# EAGLE design Famicom Controller (EAGLE 9.0.1)
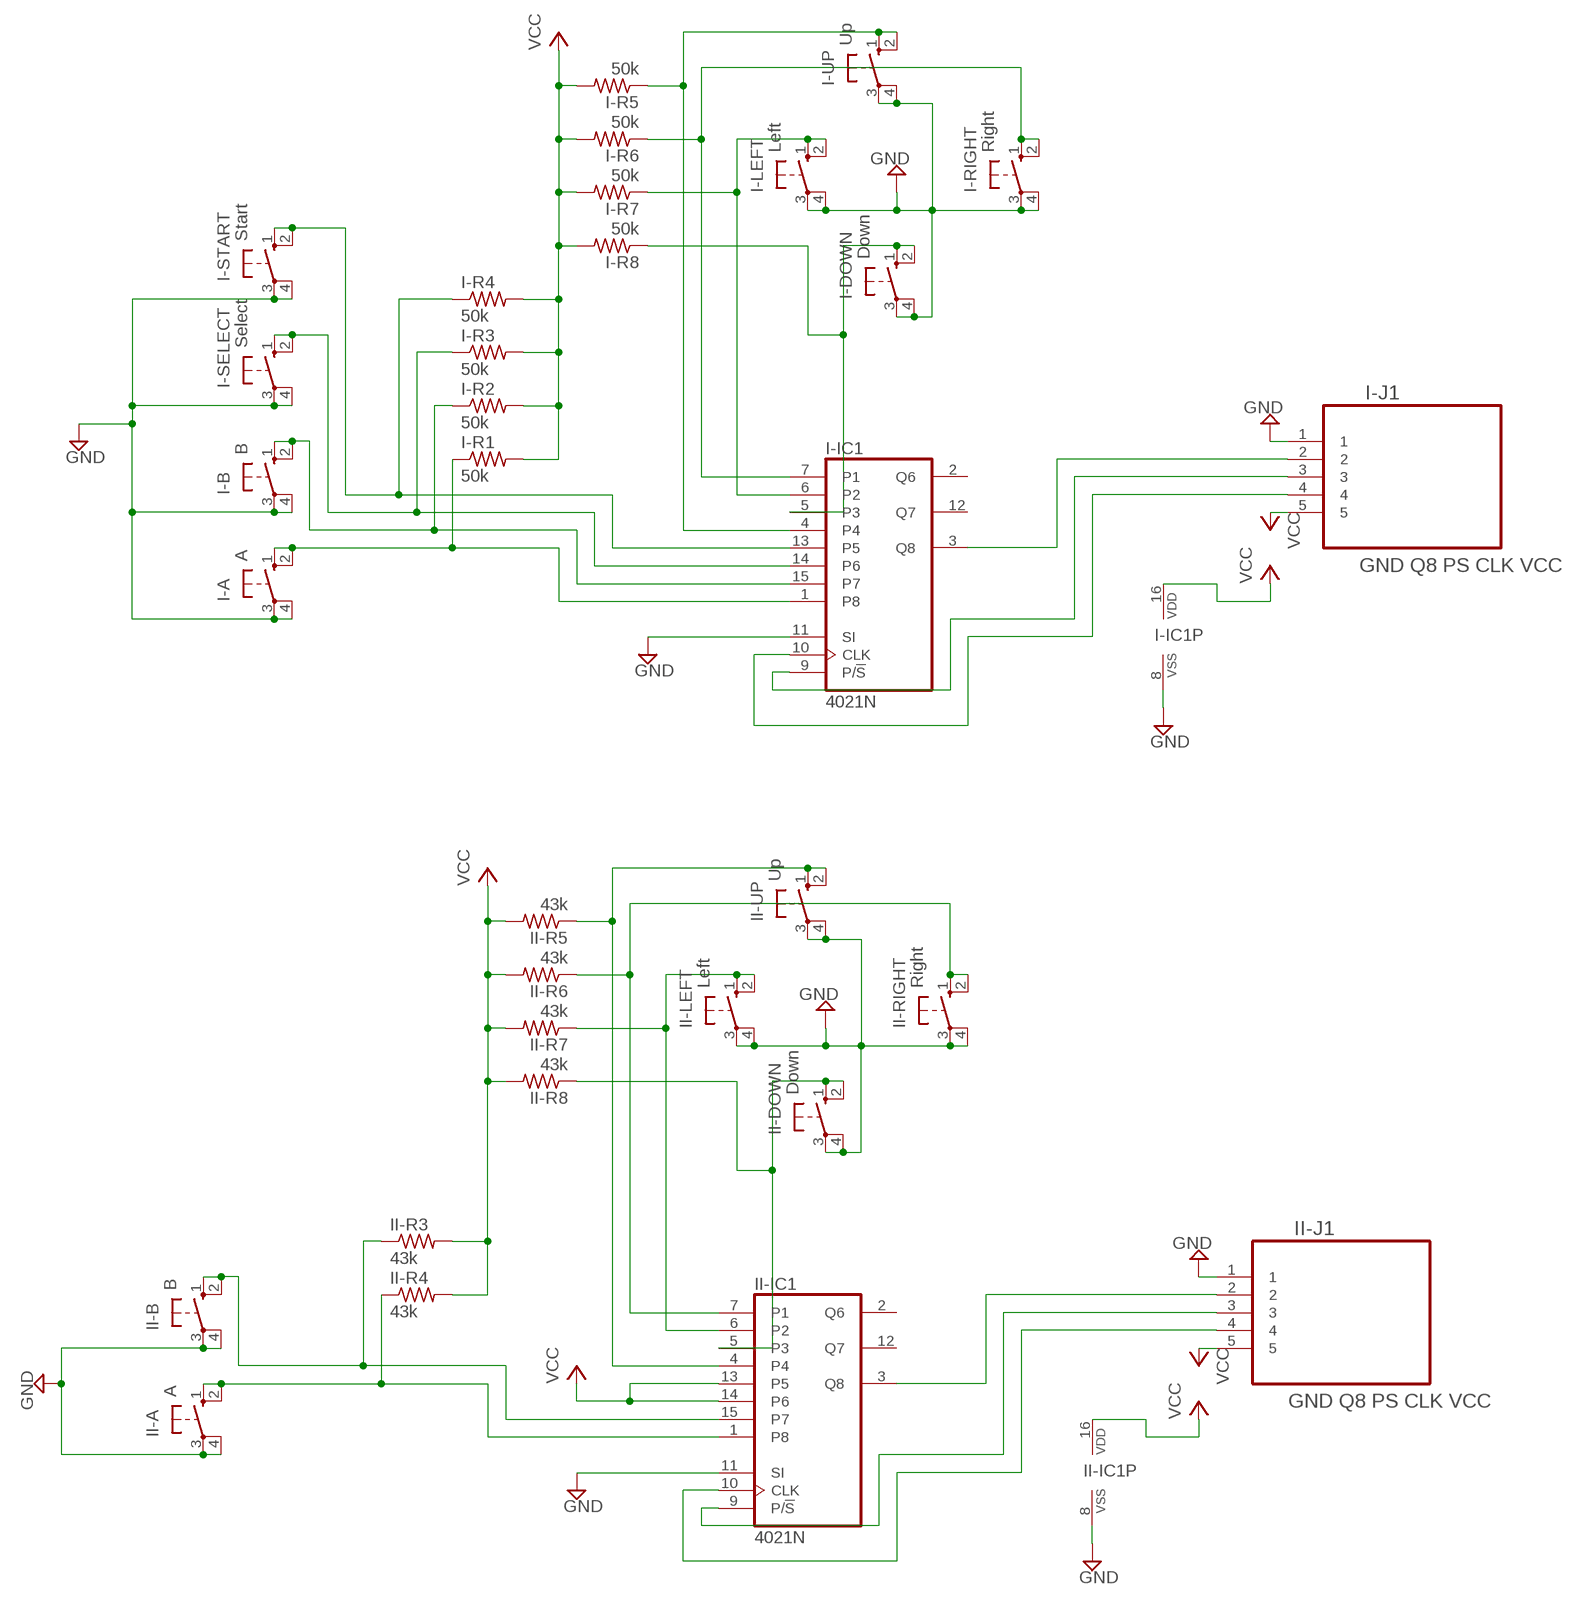
[diagram p0: schematic, sheet 1]

## Parts
I-A  A  10-XX  [B3F-10XX]
I-B  B  10-XX  [B3F-10XX]
I-DOWN  Down  10-XX  [B3F-10XX]
I-IC1  4021N  [DIL16]
I-J1  GND Q8 PS CLK VCC  TLW-105-05-G-S  [SAMTEC_TLW-105-05-G-S]
I-LEFT  Left  10-XX  [B3F-10XX]
I-R1  50k  R-US_0207/7  [0207/7]
I-R2  50k  R-US_0207/7  [0207/7]
I-R3  50k  R-US_0207/7  [0207/7]
I-R4  50k  R-US_0207/7  [0207/7]
I-R5  50k  R-US_0207/7  [0207/7]
I-R6  50k  R-US_0207/7  [0207/7]
I-R7  50k  R-US_0207/7  [0207/7]
I-R8  50k  R-US_0207/7  [0207/7]
I-RIGHT  Right  10-XX  [B3F-10XX]
I-SELECT  Select  10-XX  [B3F-10XX]
I-START  Start  10-XX  [B3F-10XX]
I-UP  Up  10-XX  [B3F-10XX]
II-A  A  10-XX  [B3F-10XX]
II-B  B  10-XX  [B3F-10XX]
II-DOWN  Down  10-XX  [B3F-10XX]
II-IC1  4021N  [DIL16]
II-J1  GND Q8 PS CLK VCC  TLW-105-05-G-S  [SAMTEC_TLW-105-05-G-S]
II-LEFT  Left  10-XX  [B3F-10XX]
II-R3  43k  R-US_0207/7  [0207/7]
II-R4  43k  R-US_0207/7  [0207/7]
II-R5  43k  R-US_0207/7  [0207/7]
II-R6  43k  R-US_0207/7  [0207/7]
II-R7  43k  R-US_0207/7  [0207/7]
II-R8  43k  R-US_0207/7  [0207/7]
II-RIGHT  Right  10-XX  [B3F-10XX]
II-UP  Up  10-XX  [B3F-10XX]

## Nets
GND: I-A.3(P) I-A.4(P1) I-B.3(P) I-B.4(P1) I-DOWN.3(P) I-DOWN.4(P1) I-IC1.8(VSS) I-IC1.11(SI) I-J1.1 I-LEFT.3(P) I-LEFT.4(P1) I-RIGHT.3(P) I-RIGHT.4(P1) I-SELECT.3(P) I-SELECT.4(P1) I-START.3(P) I-START.4(P1) I-UP.3(P) I-UP.4(P1) II-A.3(P) II-A.4(P1) II-B.3(P) II-B.4(P1) II-DOWN.3(P) II-DOWN.4(P1) II-IC1.8(VSS) II-IC1.11(SI) II-J1.1 II-LEFT.3(P) II-LEFT.4(P1) II-RIGHT.3(P) II-RIGHT.4(P1) II-UP.3(P) II-UP.4(P1)
N$1: I-IC1.3(Q8) I-J1.2
N$2: I-IC1.9(P/!S) I-J1.3
N$3: I-IC1.10(CLK) I-J1.4
N$4: I-DOWN.1(S) I-DOWN.2(S1) I-IC1.5(P3) I-R8.1
N$5: I-IC1.4 I-R5.1 I-UP.1(S) I-UP.2(S1)
N$6: I-IC1.6(P2) I-LEFT.1(S) I-LEFT.2(S1) I-R7.1
N$7: I-B.1(S) I-B.2(S1) I-IC1.15(P7) I-R2.1
N$8: I-A.1(S) I-A.2(S1) I-IC1.1(P8) I-R1.1
N$9: I-IC1.13(P5) I-R4.1 I-START.1(S) I-START.2(S1)
N$10: I-IC1.14(P6) I-R3.1 I-SELECT.1(S) I-SELECT.2(S1)
N$11: I-IC1.7(P1) I-R6.1 I-RIGHT.1(S) I-RIGHT.2(S1)
N$12: II-IC1.3(Q8) II-J1.2
N$13: II-IC1.9(P/!S) II-J1.3
N$14: II-IC1.10(CLK) II-J1.4
N$15: II-B.1(S) II-B.2(S1) II-IC1.15(P7) II-R3.1
N$16: II-A.1(S) II-A.2(S1) II-IC1.1(P8) II-R4.1
N$19: II-DOWN.1(S) II-DOWN.2(S1) II-IC1.5(P3) II-R8.1
N$20: II-IC1.4 II-R5.1 II-UP.1(S) II-UP.2(S1)
N$21: II-IC1.6(P2) II-LEFT.1(S) II-LEFT.2(S1) II-R7.1
N$22: II-IC1.7(P1) II-R6.1 II-RIGHT.1(S) II-RIGHT.2(S1)
VCC: I-IC1.16(VDD) I-J1.5 I-R1.2 I-R2.2 I-R3.2 I-R4.2 I-R5.2 I-R6.2 I-R7.2 I-R8.2 II-IC1.13(P5) II-IC1.14(P6) II-IC1.16(VDD) II-J1.5 II-R3.2 II-R4.2 II-R5.2 II-R6.2 II-R7.2 II-R8.2
Unconnected: I-IC1.2(Q6) I-IC1.12(Q7) II-IC1.2(Q6) II-IC1.12(Q7)

## Library data of the parts
I-A I-B I-DOWN I-LEFT I-RIGHT I-SELECT I-START I-UP II-A II-B II-DOWN II-LEFT II-RIGHT II-UP = switch-omron:10-XX: OMRON SWITCH; MPN: B3F-1000; OC_FARNELL: 176432; OC_NEWARK: 36M3542
I-IC1 II-IC1 = 40xx:4021: 8-bit static SHIFT REGISTER
I-J1 II-J1 = SAMTEC-Txx_By_element14_Batch_1:TLW-105-05-G-S: CONNECTOR HEADER, 5 WAY, 1ROW; MPN: TLW-105-05-G-S; OC_FARNELL: 1668495; OC_NEWARK: 12P0397; PACKAGE: CONN HEADER 5 POS .100 inch; SUPPLIER: SAMTEC
I-R1-I-R8 II-R3-II-R8 = adafruit:R-US_: RESISTOR, American symbol

## Board
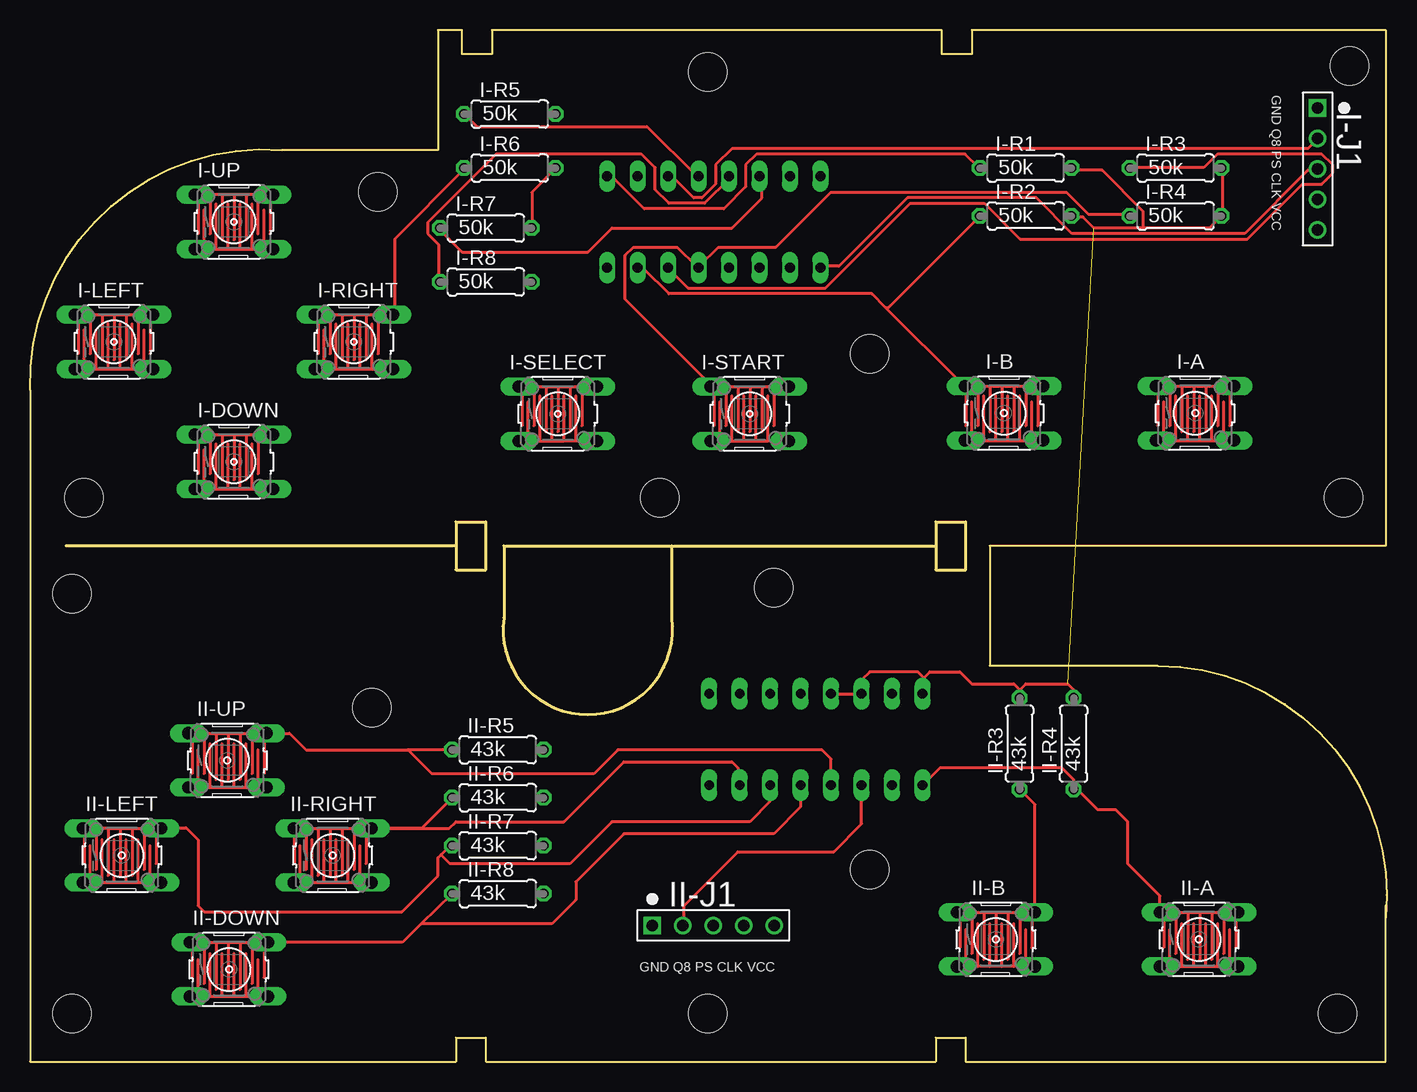
[diagram p1: board, top side]
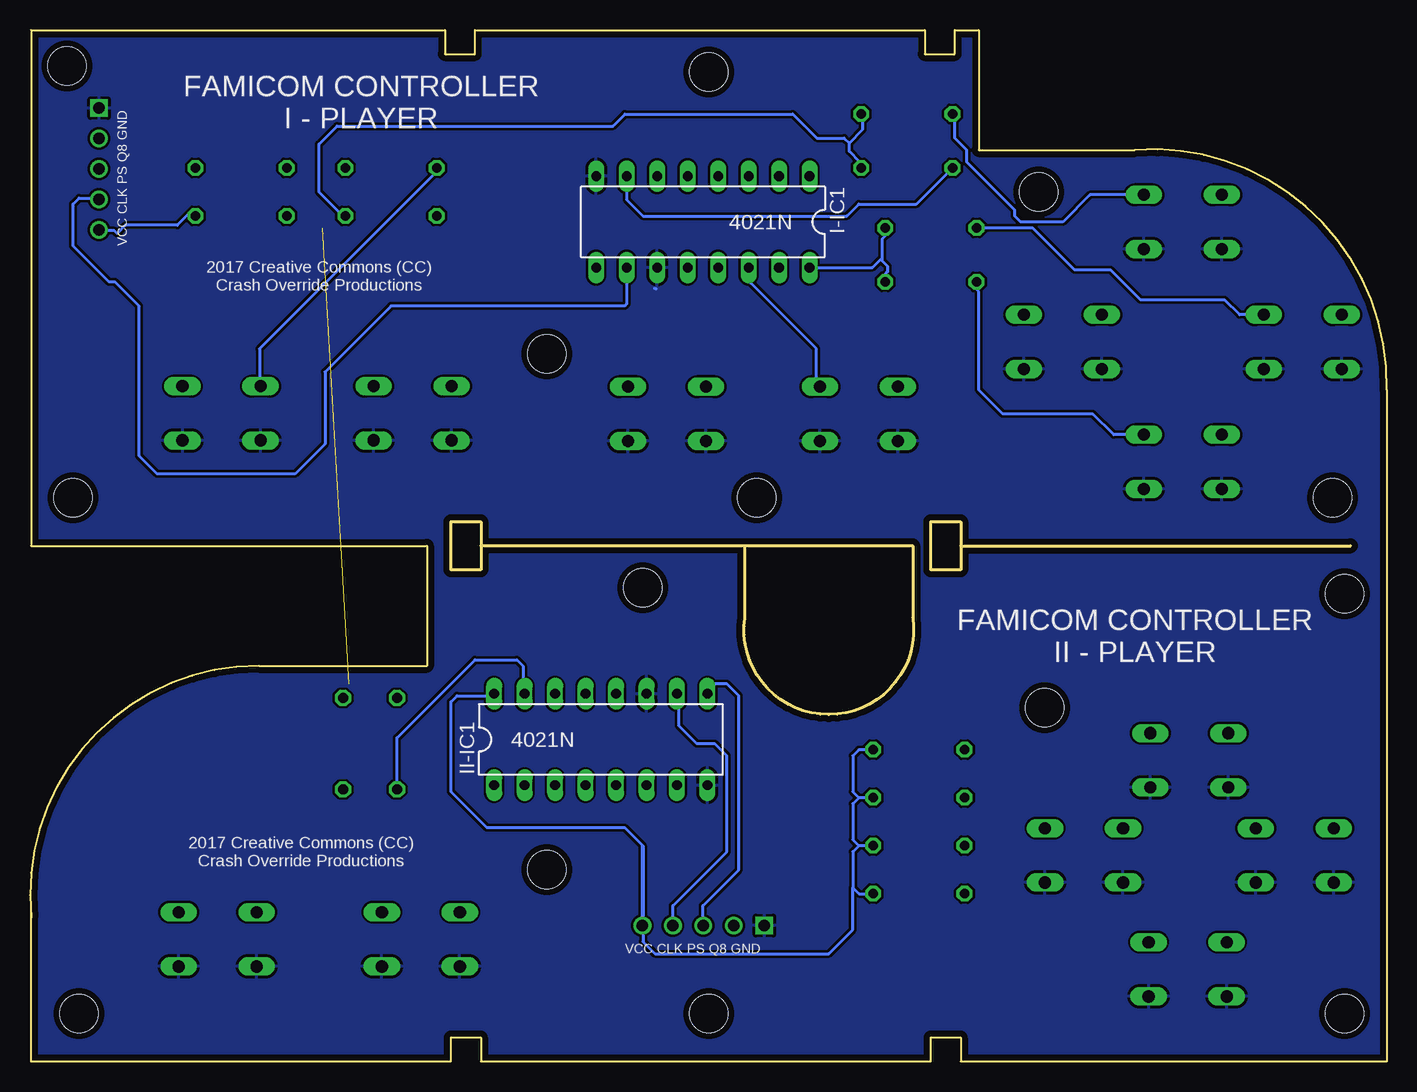
[diagram p2: board, bottom side, seen from below]

Size 113.1 x 86 mm. Coordinates in mm from the lower left corner, seen from the top.
Outline: 35.5,43 35.5,45 38,45 38,43 38,41 35.5,41 35.5,43
Outline: 75.5,43 75.5,45 78,45 78,41 75.5,41 75.5,43
Outline: 53.5,43 39.5,43 39.5,37 arc196 53.5,37 53.5,43
Outline: 113,12 113,0 78,0 78,2 75.5,2 75.5,0 38,0 38,2 35.5,2 35.5,0 0,0 0,56 arc-96 21,76 34,76 34,86 36,86 36,84 38.5,84 38.5,86 76,86 76,84 78.5,84 78.5,86 113,86 113,43 80,43 80,33 94,33 arc-96 113,12
Outline: 113,12 113,13
Outline: 35.5,43 3,43
Outline: 53.5,43 75.5,43
Copper layers (1*16): Top 0.035mm / dielectric 1.5mm / Bottom 0.035mm
Design rules "default *": minimum track width 10mil, minimum drill 24mil, track to track 8mil, track to pad 8mil, pad to pad 8mil, via to via 8mil, smd to smd 8mil, copper to edge 20mil, drill to drill 8mil, minimum pad ring 10mil, minimum via ring 8mil, stop-mask expansion 4mil, vias tented up to drill 0mil, thermal gap 10mil
Holes 3.2 mm at 109,4 56.5,4 3.5,4 3.5,39 62,39.5 70,16 28.5,29.5 110,83 109.5,47 4.5,47 52.5,47 29,72.5 56.5,82.5 70,59

### Footprints (pad centres in the part's own frame; a part is rotated, then mirrored left to right if it is on the bottom)
B3F-10XX = drill 1.016 long: 1 -3.251,2.261; 2 3.251,2.261; 3 -3.251,-2.261; 4 3.251,-2.261
DIL16 = drill 0.813 long: 1 -8.89,-3.81; 2 -6.35,-3.81; 3 -3.81,-3.81; 4 -1.27,-3.81; 5 1.27,-3.81; 6 3.81,-3.81; 7 6.35,-3.81; 8 8.89,-3.81; 9 8.89,3.81; 10 6.35,3.81; 11 3.81,3.81; 12 1.27,3.81; 13 -1.27,3.81; 14 -3.81,3.81; 15 -6.35,3.81; 16 -8.89,3.81
SAMTEC_TLW-105-05-G-S = drill 0.965 square: 1 -10.16,0 | drill 0.965: 2 -7.62,0; 3 -5.08,0; 4 -2.54,0; 5 0,0
0207/7 = drill 0.813 octagon: 1 -3.81,0; 2 3.81,0

### Placement (x,y rotation side)
I-A  97.13,54.05 0 top
I-B  81.2,54.05 0 top
I-DOWN  17,50 0 top
I-IC1  57,70 180 bottom
I-J1  107.34,69.33 270 top
I-LEFT  7,60 0 top
I-R1  83,74.5 0 top
I-R2  83,70.5 0 top
I-R3  95.5,74.5 0 top
I-R4  95.5,70.5 0 top
I-R5  40,79 0 top
I-R6  40,74.5 0 top
I-R7  38,69.5 0 top
I-R8  38,65 0 top
I-RIGHT  27,60 0 top
I-SELECT  44,54 0 top
I-START  60,54 0 top
I-UP  17,70 0 top
II-A  97.45,10.18 0 top
II-B  80.52,10.18 0 top
II-DOWN  16.59,7.68 0 top
II-IC1  65.51,26.85 0 bottom
II-J1  62.04,11.34 0 top
II-LEFT  7.66,17.18 0 top
II-R3  82.5,26.5 90 top
II-R4  87,26.5 90 top
II-R5  39,26 0 top
II-R6  39,22 0 top
II-R7  39,18 0 top
II-R8  39,14 0 top
II-RIGHT  25.23,17.18 0 top
II-UP  16.45,25.11 0 top

### Tracks (layer width: path | path; a pad name or v marks a point on that pad's centre or on a via)
GND
  Top 0.254: I-START.3 60.5,51.74 | 83.5,51.79 I-B.4 | 99.5,51.79 I-A.4 | 19.5,67.74 I-UP.4 | I-LEFT.3 I-LEFT.4 | I-RIGHT.3 I-RIGHT.4 | I-DOWN.3 I-DOWN.4 | 19,22.85 II-UP.4 | 10,14.92 II-LEFT.4 | 27.5,14.92 II-RIGHT.4 | 19,5.42 II-DOWN.4 | II-B.3 78,7.92 | 100,7.92 II-A.4 | I-UP.3 14.5,67.74 | 14.5,67.74 14.5,71 | 14.5,67.74 15.5,67.74 | 15.5,67.74 15.5,71.5 | 15.5,67.74 16.5,67.74 | 16.5,67.74 16.5,71.5 | 16.5,67.74 17.5,67.74 | 17.5,67.74 17.5,71.5 | 17.5,67.74 18.5,67.74 | 18.5,67.74 18.5,71.5 | 18.5,67.74 19.5,67.74 | 19.5,67.74 19.5,71 | I-LEFT.3 4.5,57.74 4.5,61 | I-LEFT.3 5.5,57.74 5.5,61 | I-LEFT.3 6.5,57.74 6.5,61.5 | I-LEFT.4 7.5,57.74 7.5,61.5 | I-LEFT.4 8.5,57.74 8.5,61.5 | I-LEFT.4 9.5,57.74 9.5,61 | I-RIGHT.3 24.5,57.74 24.5,61 | I-RIGHT.3 25.5,57.74 25.5,61.5 | I-RIGHT.3 26.5,57.74 26.5,61.5 | I-RIGHT.4 27.5,57.74 27.5,61.5 | I-RIGHT.4 28.5,57.74 28.5,61.5 | 45.5,51.74 46,51.74 I-SELECT.4 | 45.5,51.74 45.5,55.5 | 45.5,51.74 44.5,51.74 | 44.5,51.74 44.5,55.5 | 42.5,51.74 I-SELECT.3 41.5,51.74 41.5,55 | 42.5,51.74 43.5,51.74 | 43.5,51.74 43.5,55.5 | 42.5,51.74 42.5,55.5 | I-DOWN.3 14.5,47.74 14.5,51 | I-DOWN.3 15.5,47.74 15.5,51.5 | I-DOWN.3 16.5,47.74 16.5,51.5 | I-DOWN.4 17.5,47.74 17.5,51.5 | I-DOWN.4 18.5,47.74 18.5,51.5 | I-START.3 57.5,51.74 57.5,55 | I-START.3 58.5,51.74 58.5,55.5 | I-START.3 59.5,51.74 59.5,55.5 | I-START.4 61.5,51.74 | 60.5,51.74 60.5,55.5 | 60.5,51.74 61.5,51.74 | 61.5,51.74 61.5,55.5 | 79.5,51.79 I-B.3 78.5,51.79 78.5,55 | 79.5,51.79 79.5,55.5 | 79.5,51.79 80.5,51.79 | 80.5,51.79 80.5,55.5 | 80.5,51.79 81.5,51.79 | 81.5,51.79 81.5,55.5 | 81.5,51.79 82.5,51.79 | 82.5,51.79 82.5,55.5 | 82.5,51.79 83.5,51.79 | 83.5,51.79 83.5,55 | 94.5,55 94.5,51.79 I-A.3
  Top 0.254: 95.5,55.5 95.5,51.79 I-A.3 | I-A.3 96.5,51.79 | 96.5,51.79 96.5,55.5 | 96.5,51.79 97.5,51.79 | 97.5,51.79 97.5,55.5 | 97.5,51.79 98.5,51.79 | 98.5,51.79 98.5,55.5 | 98.5,51.79 99.5,51.79 | 99.5,51.79 99.5,55 | II-LEFT.3 5,14.92 | 5,14.92 5,18 | 5,14.92 6,14.92 | 6,14.92 6,18.5 | 6,14.92 7,14.92 | 7,14.92 7,18.5 | 7,14.92 8,14.92 | 8,14.92 8,18.5 | 8,14.92 9,14.92 | 9,14.92 9,18.5 | 9,14.92 10,14.92 | 10,14.92 10,18 | II-UP.3 14,22.85 | 14,22.85 14,26 | 14,22.85 15,22.85 | 15,22.85 15,26.5 | 15,22.85 16,22.85 | 16,22.85 16,26.5 | 16,22.85 17,22.85 | 17,22.85 17,26.5 | 17,22.85 18,22.85 | 18,22.85 18,26.5 | 18,22.85 19,22.85 | 19,22.85 19,26 | II-RIGHT.3 22.5,14.92 | 22.5,14.92 22.5,18 | 22.5,14.92 23.5,14.92 | 23.5,14.92 23.5,18.5 | 23.5,14.92 24.5,14.92 | 24.5,14.92 24.5,18.5 | 24.5,14.92 25.5,14.92 | 25.5,14.92 25.5,18.5 | 25.5,14.92 26.5,14.92 | 26.5,14.92 26.5,18.5 | 26.5,14.92 27.5,14.92 | 27.5,14.92 27.5,18 | II-DOWN.3 14,5.42 | 14,5.42 14,8.5 | 14,5.42 15,5.42 | 15,5.42 15,9 | 15,5.42 16,5.42 | 16,5.42 16,9 | 16,5.42 17,5.42 | 17,5.42 17,9 | 17,5.42 18,5.42 | 18,5.42 18,9 | 18,5.42 19,5.42 | 19,5.42 19,8.5 | 83,11 83,7.92 II-B.4 82,7.92 | 82,7.92 82,11.5 | 82,7.92 81,7.92 | 81,7.92 81,11.5 | 81,7.92 80,7.92 | 80,7.92 80,11.5 | 80,7.92 79,7.92 | 79,7.92 79,11.5 | 79,7.92 78,7.92 | 78,7.92 78,11 | 95,11 95,7.92 II-A.3 96,7.92 | 96,7.92 96,11.5 | 96,7.92 97,7.92 | 97,7.92 97,11.5 | 97,7.92 98,7.92 | 98,7.92 98,11.5 | 98,7.92 99,7.92 | 99,7.92 99,11.5 | 99,7.92 100,7.92 | 100,7.92 100,11 | 43.5,51.74 44.5,51.74
  Bottom 0.254: 61.04,64.47 60.9,64.41
  pour Bottom: 0,0 35.5,0 35.5,2 38,2 38,0 75.5,0 75.5,2 78,2 78,0.5 arc90 78.5,0 112.5,0 arc90 113,0.5 113,14.5 arc90 94.5,33 80,33 80,43 113,43 113,86 78.5,86 78.5,84.5 78.5,84 76,84 76,86 38.5,86 38.5,84 36,84 36,86 34,86 34,76 18,76 17.5,76 arc90 0,58.5
N$1
  Top 0.254: I-IC1.3 53.26,73.61 53.72,73.61 55.32,72.01 56.01,72.01 57.15,73.15 57.15,74.75 58.52,76.12 106.53,76.12 107.21,76.81 I-J1.2
N$2
  Top 0.254: I-IC1.9 66.06,66.29 67.44,66.29 73.15,72.01 83.9,72.01 86.87,69.04 101.27,69.04 106.53,74.3 107.21,74.3 I-J1.3
N$3
  Bottom 0.254: I-IC1.10 63.35,63.15 63.5,63 83,63 88.5,57.5 88.5,51.5 91,49 102.5,49 104,50.5 104,63 106,65 106.5,65 109.5,68 109.5,71.5 109,72 107.47,72 I-J1.4
N$4
  Top 0.254: 19,52.26 I-DOWN.2 | I-R8.1 34.06,65.15 34.06,68.12 33.15,69.04 33.15,69.95 38.86,75.67 50.98,75.67 52.12,74.52 52.12,72.69 53.26,71.55 56.24,71.55 58.29,73.61 I-IC1.5 | I-DOWN.1 14,52.26 | 14,52.26 14,49 | 14,52.26 15,52.26 | 15,52.26 15,49 | 15,52.26 16,52.26 | 16,52.26 16,48.5 | 16,52.26 17,52.26 | 17,52.26 17,48.5 | 17,52.26 18,52.26 | 18,52.26 18,48.5 | 18,52.26 19,52.26 | 19,52.26 19,49
  Bottom 0.254: I-R8.1 34.29,64.92 34.29,64.47 34,64.17 34,56 32,54 24.5,54 22.76,52.26 I-DOWN.2
N$5
  Top 0.254: I-UP.1 14,72.26 | I-IC1.4 55.55,73.84 51.44,77.95 37.26,77.95 36.35,78.87 I-R5.1 | 20,72.26 20,69 | 20,72.26 19,72.26 | 19,69 19,72.26 | 19,72.26 18,72.26 | 18,72.26 18,68.5 | 18,72.26 17,72.26 | 17,72.26 17,68.5 | 17,72.26 16,72.26 | 16,72.26 16,68.5 | 16,72.26 15,72.26 | 15,72.26 15,69 | 15,72.26 14,72.26 | 14,72.26 14,69 | 20,72.26 I-UP.2
  Bottom 0.254: I-UP.2 24.74,72.26 27,70 30.5,70 31,70.5 31,71 35,75 35,76 36,77 36,78.81 I-R5.1
N$6
  Top 0.254: 10,62.26 I-LEFT.2 | I-R7.1 34.19,69.31 36,67.5 46.5,67.5 48.5,69.5 58.5,69.5 61,72 61,73.62 I-IC1.6 | I-LEFT.1 5,62.26 5,59 | I-LEFT.1 6,62.26 | 6,62.26 6,58.5 | 6,62.26 7,62.26 | 7,62.26 7,58.5 | 7,62.26 8,62.26 | 8,62.26 8,58.5 | 8,62.26 9,62.26 | 9,62.26 9,59 | 9,62.26 10,62.26 | 10,62.26 10,59 | 4,59 4,61 4,62 4,62.26 I-LEFT.1
  Bottom 0.254: I-LEFT.2 12.26,62.26 13.5,63.5 20.5,63.5 23,66 26,66 29.5,69.5 I-R7.1
N$7
  Top 0.254: 84,56.31 I-B.2 | 71.32,62.87 77.72,56.46 I-B.1 78,56.31 | 71.32,62.87 70.18,64.01 53.26,64.01 51.21,66.06 50.75,66.06 I-IC1.15 | 71.32,62.87 71.55,62.87 79.1,70.41 I-R2.1 | 78,56.31 78,53 | 78,56.31 79,56.31 | 79,56.31 79,53 | 79,56.31 80,56.31 | 80,56.31 80,52.5 | 80,56.31 81,56.31 | 81,56.31 81,52.5 | 81,56.31 82,56.31 | 82,56.31 82,52.5 | 82,56.31 83,56.31 | 83,56.31 83,53 | 83,56.31 84,56.31 | 84,56.31 84,53
N$8
  Top 0.254: I-A.2 100,56.31 | I-IC1.1 48.23,73.61 48.69,73.61 51.21,71.09 57.84,71.09 59.66,72.92 59.66,74.75 60.58,75.67 77.95,75.67 79.1,74.52 I-R1.1 | I-A.1 94,56.31 | 94,56.31 94,53 | 94,56.31 95,56.31 | 95,56.31 95,53 | 95,56.31 96,56.31 | 96,56.31 96,52.5 | 96,56.31 97,56.31 | 97,56.31 97,52.5 | 97,56.31 98,56.31 | 98,56.31 98,52.5 | 98,56.31 99,56.31 | 99,56.31 99,53 | 99,56.31 100,56.31 | 100,56.31 100,53
  Bottom 0.254: I-A.1 93.95,56.46 93.95,59.44 79.1,74.3 I-R1.1
N$9
  Top 0.254: I-START.2 62,56.26 | I-R4.1 91.67,70.64 88.24,70.64 86.41,72.47 66.75,72.47 62.18,67.89 57.38,67.89 55.78,66.29 I-IC1.13 55.55,66.29 53.95,67.89 50.29,67.89 49.61,67.21 49.61,63.55 56.69,56.46 I-START.1 57,56.26 | 57,56.26 57,53 | 57,56.26 58,56.26 | 58,56.26 58,53 | 58,56.26 59,56.26 | 59,56.26 59,52.5 | 59,56.26 60,56.26 | 60,56.26 60,52.5 | 60,56.26 61,56.26 | 61,56.26 61,52.5 | 61,56.26 62,56.26 | 62,56.26 62,53
N$10
  Top 0.254: 46,56.26 I-SELECT.2 | I-R3.1 91.9,74.52 97.84,74.52 98.98,75.67 107.67,75.67 108.58,74.75 108.58,74.07 107.67,73.15 106.07,73.15 101.5,68.58 82.53,68.58 79.55,71.55 73.38,71.55 66.29,64.47 54.86,64.47 53.26,66.06 I-IC1.14 | I-SELECT.1 41,56.26 | 41,56.26 41,53 | 41,56.26 42,56.26 | 42,56.26 42,53 | 42,56.26 43,56.26 | 43,56.26 43,52.5 | 43,56.26 44,56.26 | 44,56.26 44,52.5 | 44,56.26 45,56.26 | 45,56.26 45,52.5 | 45,56.26 46,56.26 | 46,56.26 46,53
  Bottom 0.254: I-IC1.14 53.03,66.06 53.03,64.92 47.55,59.44 47.55,56.69 47.32,56.46 I-SELECT.2
N$11
  Top 0.254: 28,62.26 29,62.26 | I-R6.1 36.12,74.3 30.4,68.58 30.4,62.41 I-RIGHT.2 29,62.26 | I-RIGHT.1 24,62.26 | 24,62.26 24,59 | 24,62.26 25,62.26 | 25,62.26 25,59 | 25,62.26 26,62.26 | 26,62.26 26,58.5 | 26,62.26 27,62.26 | 27,62.26 27,58.5 | 27,62.26 28,62.26 | 28,62.26 28,58.5 | 29,62.26 29,59
  Bottom 0.254: I-IC1.7 63.35,71.85 62,70.5 45,70.5 44,71.5 39.19,71.5 I-R6.1
N$12
  Top 0.254: II-J1.2 54.5,11.42 54.5,13 59,17.5 67,17.5 69.32,19.82 II-IC1.3
N$13
  Bottom 0.254: II-J1.3 57,11.38 57,13 54,16 54,30.5 55,31.5 56.5,31.5 56.62,31.38 II-IC1.9
N$14
  Bottom 0.254: II-J1.4 59.5,13 55,17.5 55,25.5 56,26.5 57.5,26.5 59,28 59,30.5 II-IC1.10
N$15
  Top 0.254: 83.5,12.44 II-B.2 83.77,21.42 II-R3.1 | II-B.1 77.5,12.44 | 77.5,12.44 77.5,9.5 | 77.5,12.44 78.5,12.44 | 78.5,12.44 78.5,9 | 78.5,12.44 79.5,12.44 | 79.5,12.44 79.5,8.5 | 79.5,12.44 80.5,12.44 | 80.5,12.44 80.5,8.5 | 80.5,12.44 81.5,12.44 | 81.5,12.44 81.5,8.5 | 81.5,12.44 82.5,12.44 | 82.5,12.44 82.5,9 | 82.5,12.44 83.5,12.44 | 83.5,12.44 83.5,9.5
  Bottom 0.254: II-R3.1 82.5,27 76,33.5 72.5,33.5 72,33 72,30.8 II-IC1.15
N$16
  Top 0.254: 100.5,12.44 II-A.2 | II-IC1.1 75.86,24.5 86,24.5 87,23.5 II-R4.1 87.31,22.69 89,21 90.5,21 91.5,20 91.5,16.5 94.2,13.8 II-A.1 94.5,12.44 | 94.5,12.44 94.5,9.5 | 94.5,12.44 95.5,12.44 | 95.5,12.44 95.5,9 | 95.5,12.44 96.5,12.44 | 96.5,12.44 96.5,8.5 | 96.5,12.44 97.5,12.44 | 97.5,12.44 97.5,8.5 | 97.5,12.44 98.5,12.44 | 98.5,12.44 98.5,8.5 | 98.5,12.44 99.5,12.44 | 99.5,12.44 99.5,9 | 99.5,12.44 100.5,12.44 | 100.5,12.44 100.5,9.5
N$19
  Top 0.254: II-R8.1 32.61,11.5 | 19.5,9.94 II-DOWN.2 31.05,9.94 32.61,11.5 | II-IC1.5 64.24,21.24 62,19 49.5,19 45.5,15 45.5,13.5 43.5,11.5 32.61,11.5 | II-DOWN.1 13.5,9.94 | 13.5,9.94 13.5,7 | 13.5,9.94 14.5,9.94 | 14.5,9.94 14.5,6.5 | 14.5,9.94 15.5,9.94 | 15.5,9.94 15.5,6 | 15.5,9.94 16.5,9.94 | 16.5,9.94 16.5,6 | 16.5,9.94 17.5,9.94 | 17.5,9.94 17.5,6 | 17.5,9.94 18.5,9.94 | 18.5,9.94 18.5,6.5 | 18.5,9.94 19.5,9.94 | 19.5,9.94 19.5,7
N$20
  Top 0.254: 19.5,27.37 II-UP.2 21.63,27.37 23,26 31.5,26 | II-IC1.4 66.78,25.22 66,26 49,26 47,24 33.5,24 31.5,26 | II-R5.1 31.5,26 | II-UP.1 13.5,27.37 | 13.5,27.37 13.5,24 | 13.5,27.37 14.5,27.37 | 14.5,27.37 14.5,24 | 14.5,27.37 15.5,27.37 | 15.5,27.37 15.5,23.5 | 15.5,27.37 16.5,27.37 | 16.5,27.37 16.5,23.5 | 16.5,27.37 17.5,27.37 | 17.5,27.37 17.5,23.5 | 17.5,27.37 18.5,27.37 | 18.5,27.37 18.5,24 | 18.5,27.37 19.5,27.37 | 19.5,27.37 19.5,24
N$21
  Top 0.254: 9.5,19.44 II-LEFT.2 10.97,19.5 13,19.5 14,18.5 14,13 14.5,12.5 31,12.5 34,15.5 34,17 34.25,17.25 | 34.25,17.25 35.16,18.16 II-R7.1 | II-IC1.6 61.7,21.7 60,20 48.5,20 45,16.5 35,16.5 34.25,17.25 | II-LEFT.1 4.5,19.44 | 4.5,19.44 4.5,16.5 | 4.5,19.44 5.5,19.44 | 5.5,19.44 5.5,16 | 6.5,19.44 6.5,15.5 | 6.5,19.44 7.5,19.44 | 7.5,19.44 7.5,15.5 | 6.5,19.44 5.5,19.44 | 7.5,19.44 8.5,19.44 | 8.5,19.44 8.5,15.5 | 8.5,19.44 9.5,19.44 | 9.5,19.44 9.5,16 | 9.5,19.44 10.5,19.44 10.5,16.5
N$22
  Top 0.254: II-R6.1 32.63,19.44 II-RIGHT.2 | 28,19.44 II-RIGHT.2 | II-RIGHT.2 34.94,19.44 35.5,20 44.5,20 49.5,25 58.5,25 59,24.5 59,23.2 II-IC1.7 | II-RIGHT.1 22,19.44 | 22,19.44 22,16.5 | 22,19.44 23,19.44 | 23,19.44 23,16 | 23,19.44 24,19.44 | 24,19.44 24,15.5 | 24,19.44 25,19.44 | 25,19.44 25,15.5 | 25,19.44 26,19.44 | 26,19.44 26,15.5 | 26,19.44 27,19.44 | 27,19.44 27,16 | 27,19.44 28,19.44 | 28,19.44 28,16.5
VCC  (1 unrouted)
  Top 0.254: II-IC1.13 II-IC1.14 69.32,31.82 70,32.5 74,32.5 74.5,32 | II-IC1.16 74.5,30.76 74.5,32 | 74.5,32 75,32.5 77.5,32.5 78.5,31.5 82,31.5 82.5,31 | II-R3.2 82.5,31 | 82.5,31 83,31.5 86.5,31.5 87,31 II-R4.2 | I-R7.2 41.83,69.72 41.83,72.47 43.66,74.3 I-R6.2 | 92.81,69.49 98.3,69.49 99.21,70.41 I-R4.2 99.44,70.64 99.44,74.3 I-R3.2 | 92.81,69.49 88.7,69.49 87.78,70.41 86.87,70.41 I-R2.2 | 92.81,69.49 92.81,70.87 89.38,74.3 86.87,74.3 I-R1.2
  Bottom 0.254: II-J1.5 62.04,18.04 | 62.04,18.04 63.5,19.5 75,19.5 78,22.5 78,30 77.5,30.5 75,30.5 74.5,30 74.5,30.56 II-IC1.16 | II-R5.2 44,26 44.5,25.5 44.5,22.5 44,22 | II-R6.2 44,22 | 44,22 44.5,21.5 44.5,18.5 44,18 | II-R7.2 44,18 | 44,18 44.5,17.5 44.5,14.5 | 44.5,14.5 44,14 II-R8.2 | 62.04,18.04 62,18 62,10 61,9 46.5,9 44.5,11 44.5,14.5 | 44.81,76.58 43.66,77.72 43.66,78.87 I-R5.2 | 44.81,76.58 44.81,75.89 43.89,74.98 43.89,74.52 I-R6.2 | 42.06,67 42.06,68.58 41.83,68.81 41.83,69.49 I-R7.2 | 42.06,67 42.06,66.75 41.6,66.29 41.6,65.84 41.83,65.61 41.83,65.15 I-R8.2 | I-J1.5 107.21,69.27 106.07,69.27 105.84,69.04 105.16,69.72 100.81,69.72 99.9,70.64 99.44,70.64 I-R4.2 | I-R2.2 87,70.5 89,72.5 89,76.5 87.5,78 64.5,78 63.5,79 49.5,79 47.5,77 45.23,77 44.81,76.58 | I-IC1.16 42.87,66.19 42.06,67

### Text on the board
bPlace: FAMICOM CONTROLLER / I - PLAYER | VCC CLK PS Q8 GND | 2017 Creative Commons (CC) / Crash Override Productions | FAMICOM CONTROLLER / II - PLAYER | 2017 Creative Commons (CC) / Crash Override Productions | VCC CLK PS Q8 GND